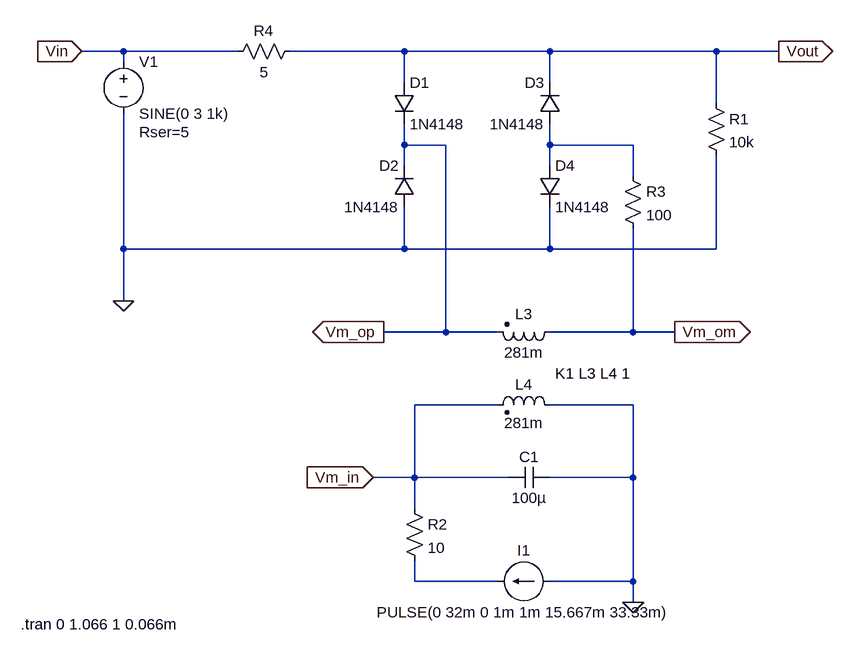
[diagram p0: schematic Voice Changer 2.asc]
Voice Changer 2.asc, the LTspice schematic file:
Version 4
SHEET 1 880 680
WIRE -624 -368 -688 -368
WIRE -448 -368 -624 -368
WIRE -192 -368 -368 -368
WIRE 32 -368 -192 -368
WIRE 288 -368 32 -368
WIRE 384 -368 288 -368
WIRE -624 -352 -624 -368
WIRE -192 -320 -192 -368
WIRE 32 -320 32 -368
WIRE 288 -288 288 -368
WIRE -192 -224 -192 -256
WIRE -128 -224 -192 -224
WIRE 32 -224 32 -256
WIRE 160 -224 32 -224
WIRE -192 -192 -192 -224
WIRE 32 -192 32 -224
WIRE 160 -176 160 -224
WIRE -624 -64 -624 -272
WIRE -192 -64 -192 -128
WIRE -192 -64 -624 -64
WIRE 32 -64 32 -128
WIRE 32 -64 -192 -64
WIRE 288 -64 288 -208
WIRE 288 -64 32 -64
WIRE -624 16 -624 -64
WIRE -128 64 -128 -224
WIRE -128 64 -224 64
WIRE -48 64 -128 64
WIRE 160 64 160 -96
WIRE 160 64 32 64
WIRE 224 64 160 64
WIRE -48 176 -176 176
WIRE 160 176 32 176
WIRE -176 288 -176 176
WIRE -176 288 -240 288
WIRE -32 288 -176 288
WIRE 160 288 160 176
WIRE 160 288 32 288
WIRE -176 336 -176 288
WIRE -176 448 -176 416
WIRE -48 448 -176 448
WIRE 160 448 160 288
WIRE 160 448 32 448
WIRE 160 480 160 448
FLAG 160 480 0
FLAG -624 16 0
FLAG -688 -368 Vin
IOPIN -688 -368 In
FLAG 384 -368 Vout
IOPIN 384 -368 Out
FLAG -240 288 Vm_in
IOPIN -240 288 In
FLAG 224 64 Vm_om
IOPIN 224 64 Out
FLAG -224 64 Vm_op
IOPIN -224 64 Out
SYMBOL ind2 48 48 R90
WINDOW 0 4 56 VBottom 2
WINDOW 3 32 56 VTop 2
SYMATTR InstName L3
SYMATTR Value 281m
SYMATTR Type ind
SYMATTR SpiceLine Rser=5
SYMBOL ind2 48 192 M270
WINDOW 0 32 56 VTop 2
WINDOW 3 4 56 VBottom 2
SYMATTR InstName L4
SYMATTR Value 281m
SYMATTR Type ind
SYMATTR SpiceLine Rser=5
SYMBOL diode -208 -320 R0
SYMATTR InstName D1
SYMATTR Value 1N4148
SYMBOL diode -176 -128 R180
WINDOW 0 24 64 Left 2
WINDOW 3 24 0 Left 2
SYMATTR InstName D2
SYMATTR Value 1N4148
SYMBOL diode 48 -256 R180
WINDOW 0 24 64 Left 2
WINDOW 3 24 0 Left 2
SYMATTR InstName D3
SYMATTR Value 1N4148
SYMBOL diode 16 -192 R0
SYMATTR InstName D4
SYMATTR Value 1N4148
SYMBOL cap 32 272 R90
WINDOW 0 0 32 VBottom 2
WINDOW 3 32 32 VTop 2
SYMATTR InstName C1
SYMATTR Value 100µ
SYMBOL current 32 448 R90
WINDOW 0 -32 40 VBottom 2
WINDOW 3 32 40 VTop 2
WINDOW 123 0 0 Left 0
WINDOW 39 0 0 Left 0
SYMATTR InstName I1
SYMATTR Value PULSE(0 32m 0 1m 1m 15.667m 33.33m)
SYMBOL res 272 -304 R0
SYMATTR InstName R1
SYMATTR Value 10k
SYMBOL voltage -624 -368 R0
WINDOW 123 0 0 Left 0
WINDOW 39 24 124 Left 2
SYMATTR InstName V1
SYMATTR Value SINE(0 3 1k)
SYMATTR SpiceLine Rser=5
SYMBOL res -192 320 R0
SYMATTR InstName R2
SYMATTR Value 10
SYMBOL res -464 -352 R270
WINDOW 0 32 56 VTop 2
WINDOW 3 0 56 VBottom 2
SYMATTR InstName R4
SYMATTR Value 5
SYMBOL res 144 -192 R0
SYMATTR InstName R3
SYMATTR Value 100
TEXT 40 128 Left 2 !K1 L3 L4 1
TEXT -782 514 Left 2 !.tran 0 1.066 1 0.066m

The netlist it stands for:
* Voice Changer 2.asc
L3 Vm_om Vm_op 281m Rser=5
L4 0 Vm_in 281m Rser=5
D1 Vout Vm_op 1N4148
D2 0 Vm_op 1N4148
D3 N001 Vout 1N4148
D4 N001 0 1N4148
C1 0 Vm_in 100µ
I1 0 N002 PULSE(0 32m 0 1m 1m 15.667m 33.33m)
R1 Vout 0 10k
V1 Vin 0 SINE(0 3 1k) Rser=5
R2 Vm_in N002 10
R4 Vin Vout 5
R3 N001 Vm_om 100
.model D D
.lib standard.dio
K1 L3 L4 1
.tran 0 1.066 1 0.066m
.backanno
.end